# Altium schematic sheet lpGBT-SC-HSIO.SchDoc: LpGBT
size A; DocumentNumber: 9; SheetNumber: 9; SheetTotal: 22
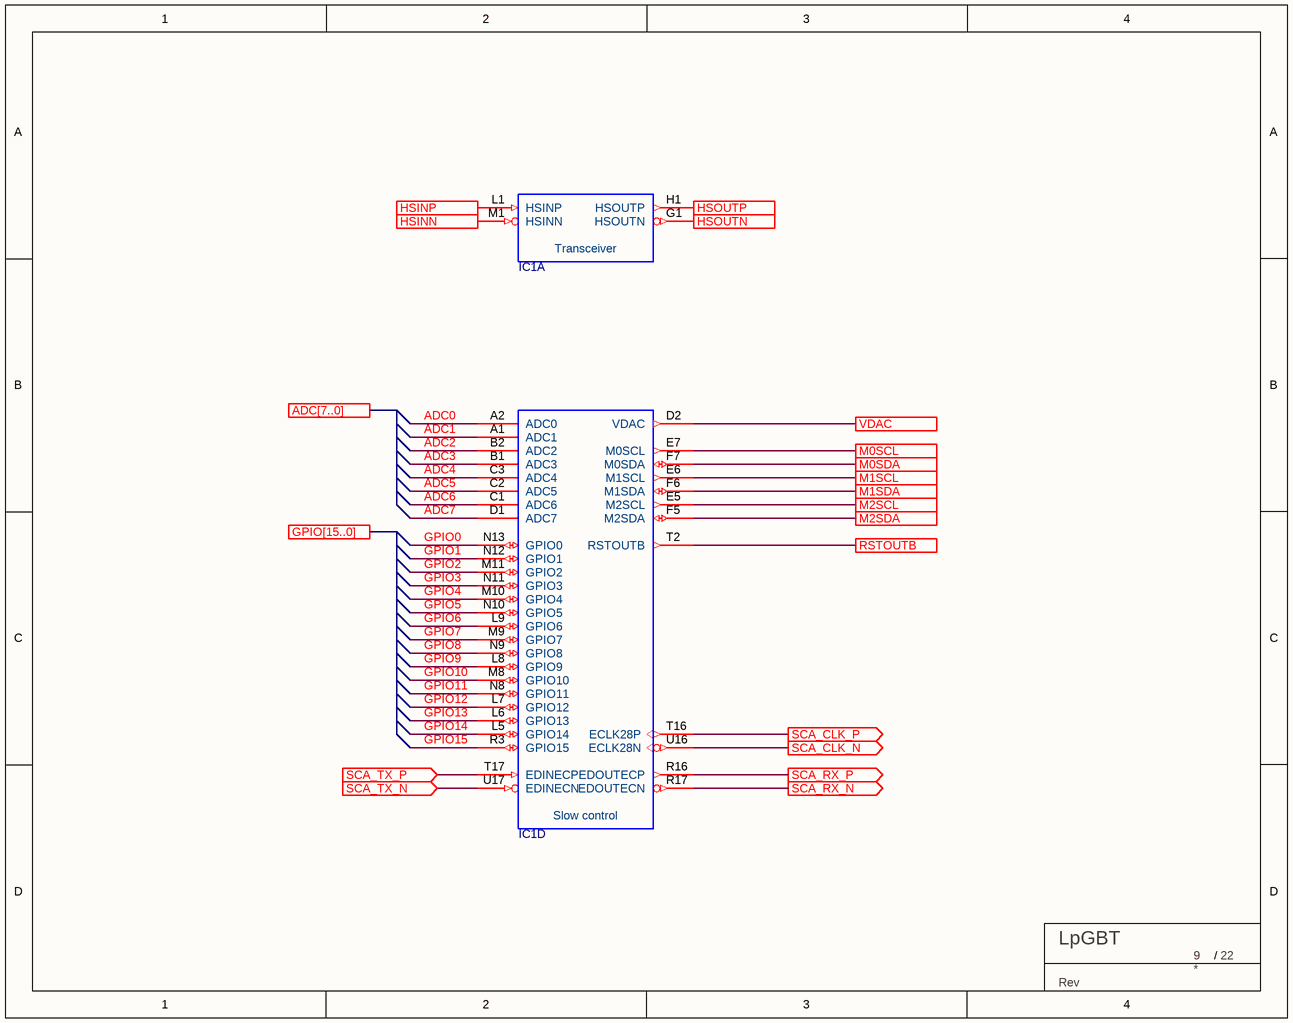
[diagram p0: lpGBT-SC-HSIO.SchDoc]

## Parts
IC1  LPGBT  [BGA289X17]  (value not drawn)  (parts A,D of 8)
TBLOCK?  BU Title block  (value not drawn)  (graphical)

## Ports
ADC[7..0], GPIO[15..0], HSINN (in), HSINP (in), HSOUTN (in), HSOUTP (in), M0SCL, M0SDA, M1SCL, M1SDA, M2SCL, M2SDA, RSTOUTB, SCA_CLK_N (out), SCA_CLK_P (out), SCA_RX_N (out), SCA_RX_P (out), SCA_TX_N (in), SCA_TX_P (in), VDAC

## Nets
ADC0: IC1.A2(ADC0)
ADC1: IC1.A1(ADC1)
ADC2: IC1.B2(ADC2)
ADC3: IC1.B1(ADC3)
ADC4: IC1.C3(ADC4)
ADC5: IC1.C2(ADC5)
ADC6: IC1.C1(ADC6)
ADC7: IC1.D1(ADC7)
GPIO0: IC1.N13(GPIO0)
GPIO1: IC1.N12(GPIO1)
GPIO2: IC1.M11(GPIO2)
GPIO3: IC1.N11(GPIO3)
GPIO4: IC1.M10(GPIO4)
GPIO5: IC1.N10(GPIO5)
GPIO6: IC1.L9(GPIO6)
GPIO7: IC1.M9(GPIO7)
GPIO8: IC1.N9(GPIO8)
GPIO9: IC1.L8(GPIO9)
GPIO10: IC1.M8(GPIO10)
GPIO11: IC1.N8(GPIO11)
GPIO12: IC1.L7(GPIO12)
GPIO13: IC1.L6(GPIO13)
GPIO14: IC1.L5(GPIO14)
GPIO15: IC1.R3(GPIO15)
HSINN: IC1.M1(HSINN) ; port HSINN
HSINP: IC1.L1(HSINP) ; port HSINP
HSOUTN: IC1.G1(HSOUTN) ; port HSOUTN
HSOUTP: IC1.H1(HSOUTP) ; port HSOUTP
M0SCL: IC1.E7(M0SCL) ; port M0SCL
M0SDA: IC1.F7(M0SDA) ; port M0SDA
M1SCL: IC1.E6(M1SCL) ; port M1SCL
M1SDA: IC1.F6(M1SDA) ; port M1SDA
M2SCL: IC1.E5(M2SCL) ; port M2SCL
M2SDA: IC1.F5(M2SDA) ; port M2SDA
RSTOUTB: IC1.T2(RSTOUTB) ; port RSTOUTB
SCA_CLK_N: IC1.U16(ECLK28N) ; port SCA_CLK_N
SCA_CLK_P: IC1.T16(ECLK28P) ; port SCA_CLK_P
SCA_RX_N: IC1.R17(EDOUTECN) ; port SCA_RX_N
SCA_RX_P: IC1.R16(EDOUTECP) ; port SCA_RX_P
SCA_TX_N: IC1.U17(EDINECN) ; port SCA_TX_N
SCA_TX_P: IC1.T17(EDINECP) ; port SCA_TX_P
VDAC: IC1.D2(VDAC) ; port VDAC

## Notes on the sheet
- (in symbol LPGBT, part A) Transceiver
- (in symbol LPGBT, part D) Slow control
- (in symbol TITLE_BLOCK_BU) /; Rev

## Library data of the parts
IC1 = LPGBT: Low Power Gigabit Transceiver; Manufacturer: CERN; Pinout Version: 180226; Bonding: No; Device: LPGBT; Manufacturer Part Number: LPGBT; SMD: Yes; Mounted: Yes; LatestRevisionDate: 26.10.2018; PackageDescription: BGA, 289-Leads, Body 9.00x9.00mmx1.28mm, Pitch 0.50mm; Part Description: Low Power Gigabit Transceiver; Case: BGA289; Part Number: LPGBT; Pin Count: 289; Socket: No; Component Kind: Standard; Component Type: Standard; Footprint: BGA289C50P17X17_900X900X128
TBLOCK? = TITLE_BLOCK_BU